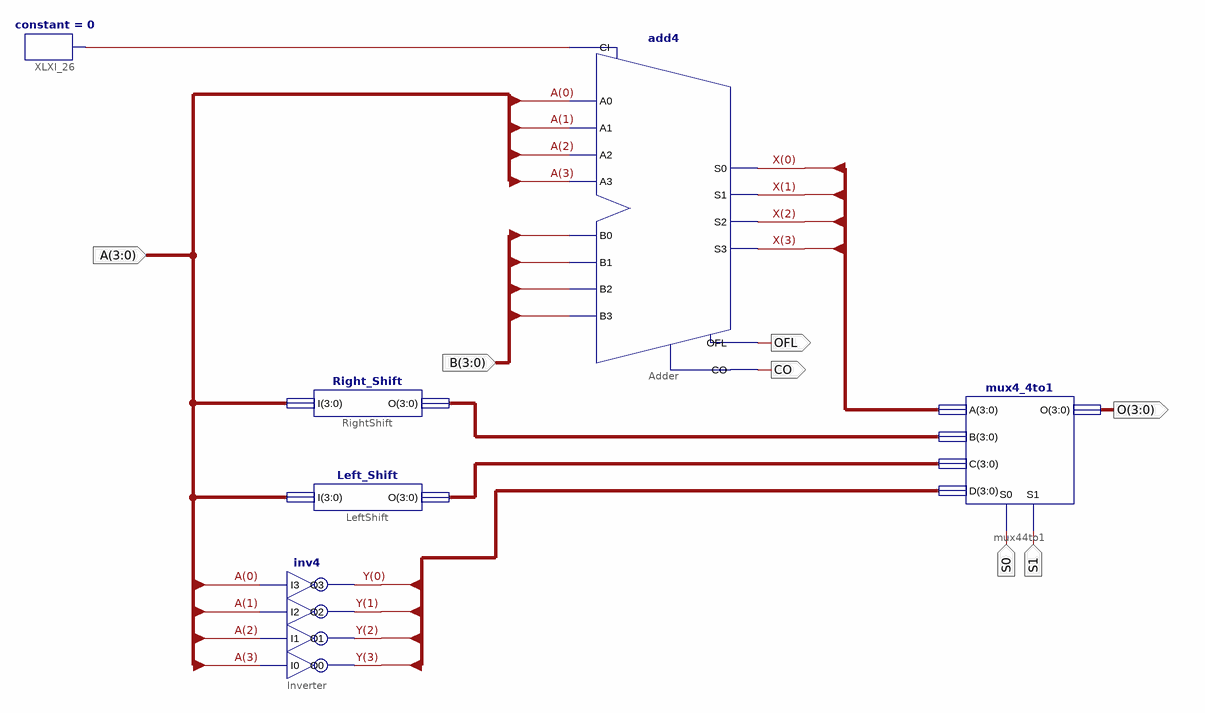
[diagram p0: schematic sheet 1]
// Xilinx ISE schematic ALU.sch (virtex6) as structural Verilog: 6 symbols, 7 ports
module ALU (
  input  [3:0] A,
  input  [3:0] B,
  input  S0,
  input  S1,
  output OFL,
  output CO,
  output [3:0] O
);

  wire CI;
  wire [3:0] W, X, Y, Z;

  constant #(.CValue("0")) XLXI_26 (.O(CI));
  mux4_4to1 mux44to1 (.A(X), .B(Z), .S0(S0), .C(W), .D(Y), .S1(S1), .O(O));
  add4 Adder (
    .A0(A[0]), .A1(A[1]), .A2(A[2]), .A3(A[3]), .B0(B[0]), .B1(B[1]), .B2(B[2]), .B3(B[3]), .CI(CI), .CO(CO),
    .OFL(OFL), .S0(X[0]), .S1(X[1]), .S2(X[2]), .S3(X[3]));
  Right_Shift RightShift (.I(A), .O(Z));
  Left_Shift LeftShift (.I(A), .O(W));
  inv4 Inverter (.I0(A[3]), .I1(A[2]), .I2(A[1]), .I3(A[0]), .O0(Y[3]), .O1(Y[2]), .O2(Y[1]), .O3(Y[0]));
endmodule
